# Altium schematic sheet MB_USB.SchDoc
size 840 x 594 mm; SheetNumber: 2; SheetTotal: 8
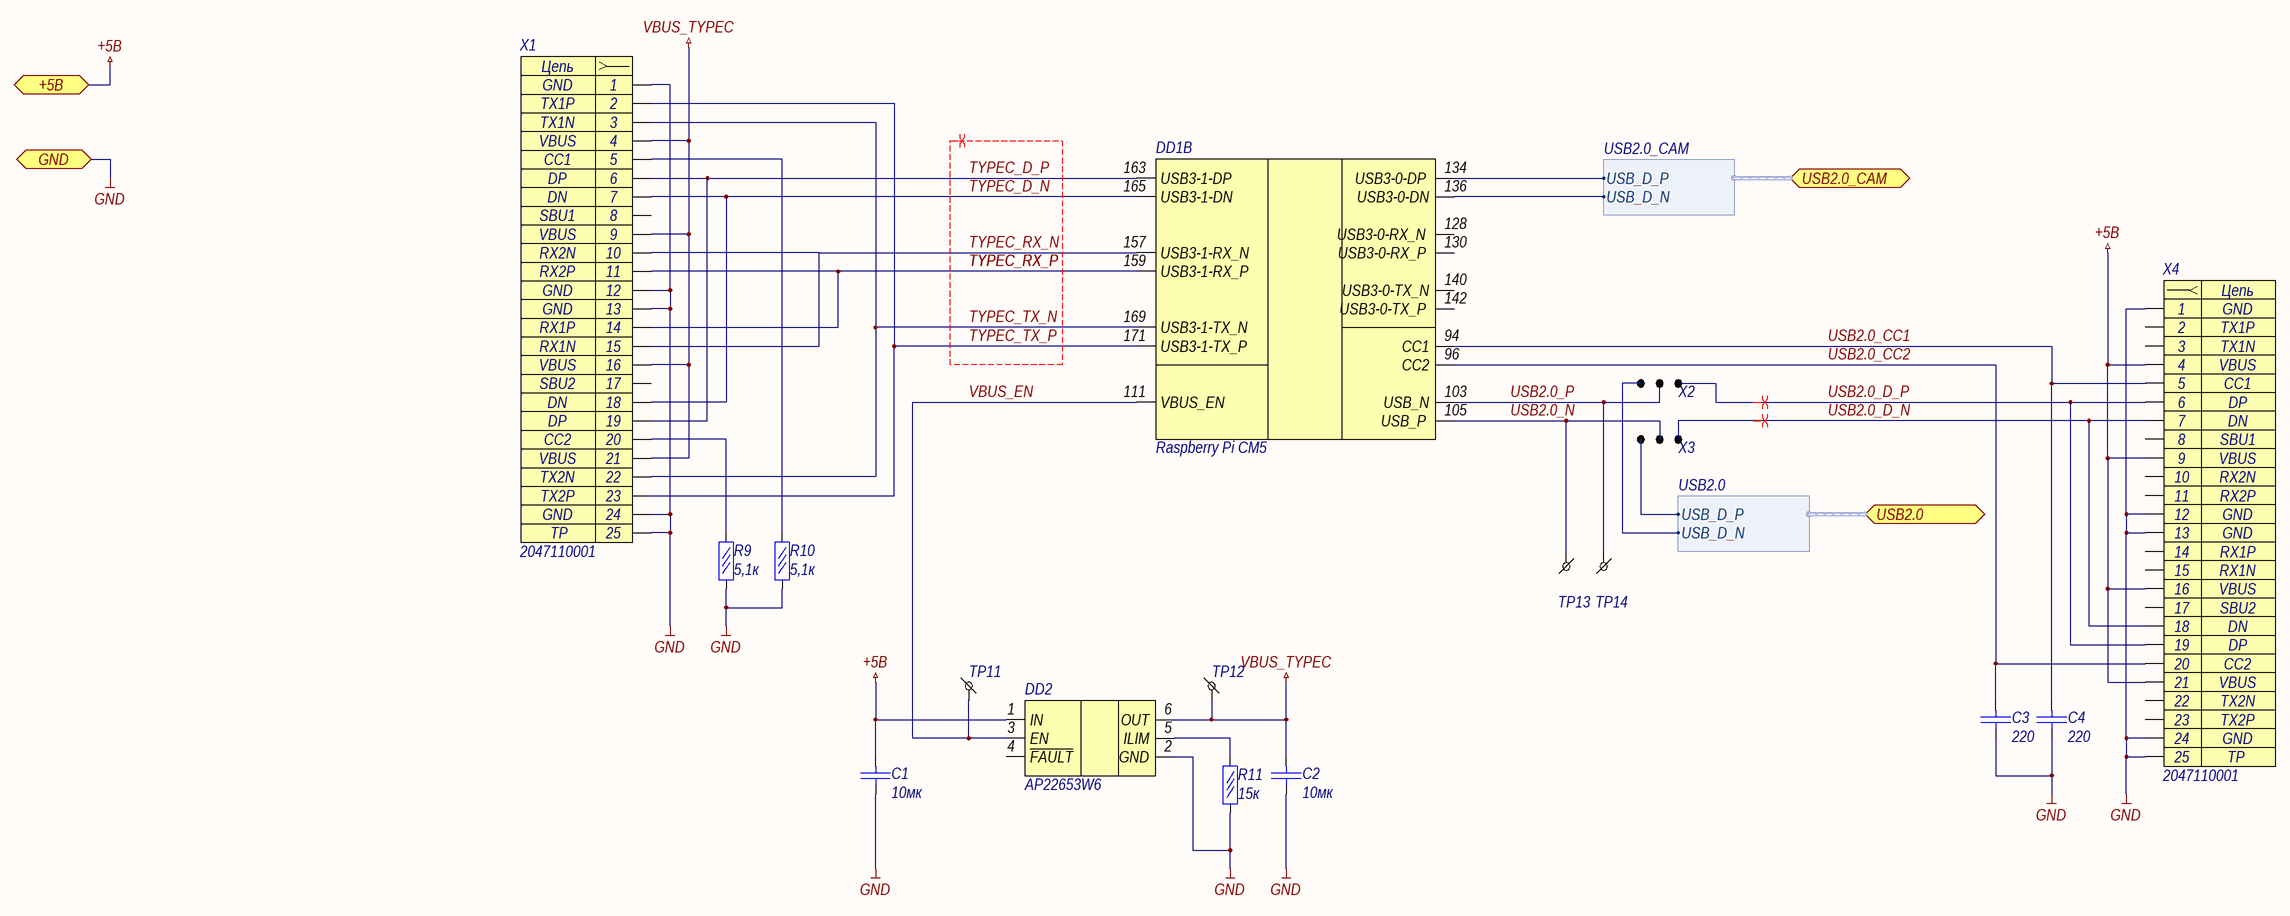
[diagram p0: MB_USB.SchDoc]

## Parts
DD1  Raspberry Pi CM5  [raspberry_pi_compute_module_4_header]  (part B of 6)
DD2  AP22653W6  [SOT23-6]
R9  5,1к  [R0402]
R10  5,1к  [R0402]
R11  15к  [R0402]
TP11  TestPoint  [0.5 x 0,9_round]  (value not drawn)
TP12  TestPoint  [0.5 x 0,9_round]  (value not drawn)
TP13  TestPoint  [0.5 x 0,9_round]  (value not drawn)
TP14  TestPoint  [0.5 x 0,9_round]  (value not drawn)
X1  2047110001  [2047110001]
X2  Jumper_3  [solid_jumper_3]  (value not drawn)  (no BOM)
X3  Jumper_3  [solid_jumper_3]  (value not drawn)  (no BOM)
X4  2047110001  [2047110001]
С1  10мк  [C0603]
С2  10мк  [C0603]
С3  220  [C0402]
С4  220  [C0402]

## Ports
+5В (bidir), GND (bidir), USB2.0 (bidir, harness USB2.0), USB2.0_CAM (bidir, harness USB2.0_CAM)

## Harnesses
USB2.0_CAM: USB_D_N, USB_D_P
USB2.0: USB_D_N, USB_D_P

## Nets
+5В: DD2.1(IN) X4.4(A6) X4.9(GND) X4.16(VCC) X4.21(VCC) С1.2 ; port +5В
GND: DD2.2(GND) R9.1 R10.1 R11.1 X1.1(B8) X1.12(VCC) X1.13(VCC) X1.24(VCC) X1.TP X4.1(B8) X4.12(VCC) X4.13(VCC) X4.24(VCC) X4.TP С1.1 С2.1 С3.1 С4.1 ; port GND
VBUS_TYPEC: DD2.6(OUT) TP12.1 X1.4(A6) X1.9(GND) X1.16(VCC) X1.21(VCC) С2.2
TYPEC_D_N: DD1.165(USB3-1-DN) X1.7(A8) X1.18(VCC)
TYPEC_D_P: DD1.163(USB3-1-DP) X1.6(B6) X1.19(VCC)
TYPEC_RX_N: DD1.157(USB3-1-RX_N) X1.10(VCC) X1.15(VCC)
TYPEC_RX_P: DD1.159(USB3-1-RX_P) X1.11(VCC) X1.14(VCC)
TYPEC_TX_N: DD1.169(USB3-1-TX_N) X1.3(B7) X1.22(VCC)
TYPEC_TX_P: DD1.171(USB3-1-TX_P) X1.2(A5) X1.23(VCC)
USB2.0_CC1: DD1.94(CC1) X4.5(A7) С4.2
USB2.0_CC2: DD1.96(CC2) X4.20(VCC) С3.2
USB2.0_D_N: X3.1 X4.7(A8) X4.18(VCC)
USB2.0_D_P: X2.1 X4.6(B6) X4.19(VCC)
USB2.0_N: DD1.105(USB_P) TP13.1 X3.2
USB2.0_P: DD1.103(USB_N) TP14.1 X2.2
VBUS_EN: DD1.111(VBUS_EN) DD2.3(EN) TP11.1
NetDD1_134: DD1.134(USB3-0-DP) ; port USB2.0_CAM.USB_D_P
NetDD1_136: DD1.136(USB3-0-DN) ; port USB2.0_CAM.USB_D_N
NetDD2_5: DD2.5(ILIM) R11.2
NetR9_2: R9.2 X1.20(VCC)
NetR10_2: R10.2 X1.5(A7)
NetX2_3: X2.3 ; port USB2.0.USB_D_N
NetX3_3: X3.3 ; port USB2.0.USB_D_P

Not connected (* = marked no-connect by the designer): DD1 128(USB3-0-RX_N_) 130(USB3-0-RX_P_) 140(USB3-0-TX_N) 142(USB3-0-TX_P_); DD2 4(~{FAULT}); X1 8(B5) 17(VCC); X4 2(A5) 3(B7) 8(B5) 10(VCC) 11(VCC) 14(VCC) 15(VCC) 17(VCC) 22(VCC) 23(VCC)

## Layout directives
differential pair; rule Differential Pairs Routing [Pref Gap = 0.3mm    Min Gap  = 0.3mm    Max Gap  = 0.3mmPref Width = 0.184mm    Min Width  = 0.184mm    Max Width  = 0.184mm]; rule Matched Net Lengths [Tolerance = 1.5mm]; rule Matched Net Lengths [Tolerance = 0.15mm]; differential pair class TypeC; net class TypeC: TYPEC_D_N, TYPEC_D_P, TYPEC_RX_N, TYPEC_RX_P, TYPEC_TX_N, TYPEC_TX_P
differential pair; rule Differential Pairs Routing [Pref Gap = 0.3mm    Min Gap  = 0.3mm    Max Gap  = 0.3mmPref Width = 0.184mm    Min Width  = 0.184mm    Max Width  = 0.184mm]; rule Matched Net Lengths [Tolerance = 1.5mm]; rule Matched Net Lengths [Tolerance = 0.15mm]: USB2.0_D_N, USB2.0_D_P

## Notes on the sheet
- Подп. и дата
- Инв. № дубл.
- Взам. инв. №
- Инв. № подл.
- Лист
- Изм.
- № докум.
- Подп.
- Дата
- Копировал
- Формат
- А1
- (in symbol 2047110001) Цепь; 25

## Library data of the parts
DD1 = Raspberry Pi CM5: Raspberry Pi Compute Module 5; Name: Raspberry Pi CM5
DD2 = AP22653W6: PRECISION ADJUSTABLE CURRENT-LIMITED POWER SWITCHES; Name: AP22653W6
R9-R11 = Резистор 0.05Вт: Резистор 0,05Вт
  R9 R10: Value: 5,1к
  R11: Value: 15к
X1 X4 = 2047110001: USB Type-C 3.1; Contact_1: GND; Contact_2: TX1P; Contact_3: TX1N; Contact_4: VBUS; Contact_5: CC1; Contact_6: DP; Contact_7: DN; Contact_8: SBU1; Contact_10: RX2N; Contact_11: RX2P; Contact_14: RX1P; Contact_15: RX1N; Contact_17: SBU2; Contact_20: CC2; Contact_22: TX2N; Contact_23: TX2P; Name: 2047110001; Contact_9: VBUS; Contact_12: GND; Contact_13: GND; Contact_16: VBUS; Contact_18: DN; Contact_19: DP; Contact_21: VBUS; Contact_24: GND
X2 X3 = Jumper x3: Перемычка паяльная на плате; ID: 28; Name: SW_Jumper_3_pins; Основной тип: Места под пайку; Доп_Тип: Перемычки; Тип корпуса: 0805; Value: Jumper_3
С1-С4 = Кер. конденсатор
  С1 С2: Value: 10мк
  С3 С4: Value: 220